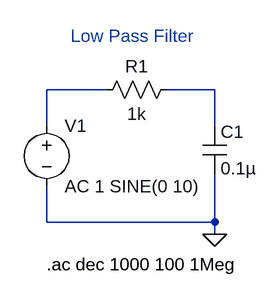
[diagram p0: schematic 3EEC_VELASCO_EXPT7_CKT1.asc]
3EEC_VELASCO_EXPT7_CKT1.asc, the LTspice schematic file:
Version 4
SHEET 1 880 680
WIRE 96 96 16 96
WIRE 240 96 176 96
WIRE 16 144 16 96
WIRE 240 144 240 96
WIRE 16 272 16 224
WIRE 240 272 240 208
WIRE 240 272 16 272
WIRE 240 288 240 272
FLAG 240 288 0
SYMBOL voltage 16 128 R0
SYMATTR InstName V1
SYMATTR Value AC 1 SINE(0 10)
SYMBOL res 192 80 R90
WINDOW 0 0 56 VBottom 2
WINDOW 3 32 56 VTop 2
SYMATTR InstName R1
SYMATTR Value 1k
SYMBOL cap 224 144 R0
SYMATTR InstName C1
SYMATTR Value 0.1µ
TEXT 16 328 Left 2 !.ac dec 1000 100 1Meg
TEXT 48 24 Left 2 ;Low Pass Filter

The netlist it stands for:
* 3EEC_VELASCO_EXPT7_CKT1.asc
V1 N001 0 AC 1 SINE(0 10)
R1 N002 N001 1k
C1 N002 0 0.1µ
.ac dec 1000 100 1Meg
* Low Pass Filter
.backanno
.end